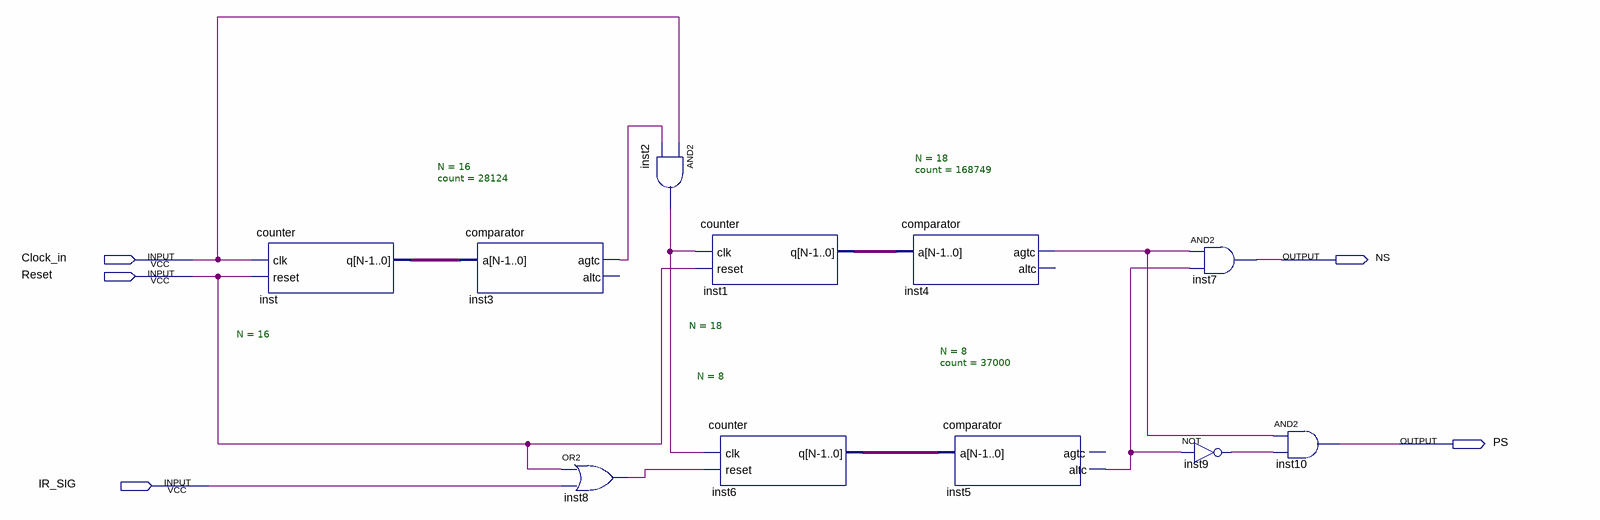
[diagram p0: schematic sheet]
// Quartus schematic FinalProject.bdf as structural Verilog: 11 symbols, 5 pins
module FinalProject (
  input  Clock_in,
  input  Reset,
  input  IR_SIG,
  output NS,
  output PS
);

  wire inst2_out, inst3_agtc, inst4_agtc, inst5_altc, inst8_out, inst9_out;
  wire [7:0] inst6_q;
  wire [15:0] inst_q;
  wire [17:0] inst1_q;

  counter #(.N(16)) inst (.clk(Clock_in), .reset(Reset), .q(inst_q));
  comparator #(.N(16), .count(28124)) inst3 (.a(inst_q), .agtc(inst3_agtc));  // open: altc
  or inst8 (inst8_out, Reset, IR_SIG);
  and inst2 (inst2_out, Clock_in, inst3_agtc);
  counter #(.N(18)) inst1 (.clk(inst2_out), .reset(Reset), .q(inst1_q));
  counter #(.N(8)) inst6 (.clk(inst2_out), .reset(inst8_out), .q(inst6_q));
  comparator #(.N(18), .count(168749)) inst4 (.a(inst1_q), .agtc(inst4_agtc));  // open: altc
  comparator #(.N(8), .count(37000)) inst5 (.a(inst6_q), .altc(inst5_altc));  // open: agtc
  and inst7 (NS, inst4_agtc, inst5_altc);
  not inst9 (inst9_out, inst5_altc);
  and inst10 (PS, inst4_agtc, inst9_out);
endmodule
